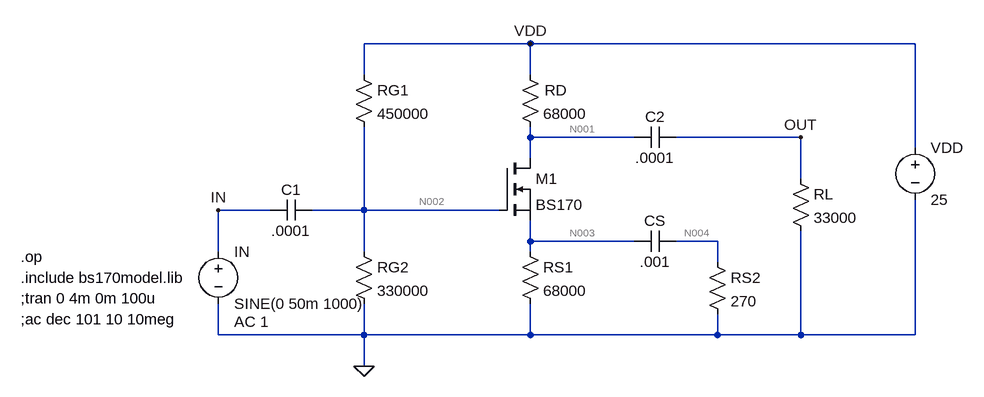
[diagram p0: schematic lab 3.asc]
lab 3.asc, the LTspice schematic file:
Version 4
SHEET 1 880 680
WIRE 128 -64 -128 -64
WIRE 720 -64 128 -64
WIRE -128 -16 -128 -64
WIRE 128 -16 128 -64
WIRE 128 80 128 64
WIRE 288 80 128 80
WIRE 544 80 352 80
WIRE 720 96 720 -64
WIRE 128 112 128 80
WIRE 544 144 544 80
WIRE -272 192 -352 192
WIRE -128 192 -128 64
WIRE -128 192 -208 192
WIRE 80 192 -128 192
WIRE 128 240 128 208
WIRE 288 240 128 240
WIRE 416 240 352 240
WIRE -352 256 -352 192
WIRE -128 256 -128 192
WIRE 128 256 128 240
WIRE 416 272 416 240
WIRE -352 384 -352 336
WIRE -128 384 -128 336
WIRE -128 384 -352 384
WIRE 128 384 128 336
WIRE 128 384 -128 384
WIRE 416 384 416 352
WIRE 416 384 128 384
WIRE 544 384 544 224
WIRE 544 384 416 384
WIRE 720 384 720 176
WIRE 720 384 544 384
WIRE -128 432 -128 384
FLAG -128 432 0
FLAG -352 192 IN
FLAG 128 -64 VDD
FLAG 544 80 OUT
SYMBOL voltage 720 80 R0
WINDOW 123 0 0 Left 2
WINDOW 39 0 0 Left 2
SYMATTR InstName VDD
SYMATTR Value 25
SYMBOL res -144 -32 R0
SYMATTR InstName RG1
SYMATTR Value 450000
SYMBOL res 112 -32 R0
WINDOW 0 38 40 Left 2
SYMATTR InstName RD
SYMATTR Value 68000
SYMBOL res -144 240 R0
SYMATTR InstName RG2
SYMATTR Value 330000
SYMBOL res 112 240 R0
SYMATTR InstName RS1
SYMATTR Value 68000
SYMBOL nmos 80 112 R0
SYMATTR InstName M1
SYMATTR Value BS170
SYMBOL cap 352 64 R90
WINDOW 0 0 32 VBottom 2
WINDOW 3 32 32 VTop 2
SYMATTR InstName C2
SYMATTR Value .0001
SYMBOL cap 352 224 R90
WINDOW 0 0 32 VBottom 2
WINDOW 3 32 32 VTop 2
SYMATTR InstName CS
SYMATTR Value .001
SYMBOL res 400 256 R0
SYMATTR InstName RS2
SYMATTR Value 270
SYMBOL res 528 128 R0
SYMATTR InstName RL
SYMATTR Value 33000
SYMBOL voltage -352 240 R0
WINDOW 123 24 124 Left 2
WINDOW 39 0 0 Left 2
SYMATTR Value2 AC 1
SYMATTR InstName IN
SYMATTR Value SINE(0 50m 1000)
SYMBOL cap -208 176 R90
WINDOW 0 0 32 VBottom 2
WINDOW 3 32 32 VTop 2
SYMATTR InstName C1
SYMATTR Value .0001
TEXT -656 264 Left 2 !.op
TEXT -656 296 Left 2 !.include bs170model.lib
TEXT -656 328 Left 2 !;tran 0 4m 0m 100u
TEXT -656 360 Left 2 !;ac dec 101 10 10meg

The netlist it stands for:
* lab 3.asc
VDD VDD 0 25
RG1 VDD N002 450000
RD VDD N001 68000
RG2 N002 0 330000
RS1 N003 0 68000
M1 N001 N002 N003 N003 BS170
C2 OUT N001 .0001
CS N004 N003 .001
RS2 N004 0 270
RL OUT 0 33000
V§IN IN 0 SINE(0 50m 1000) AC 1
C1 N002 IN .0001
.model NMOS NMOS
.model PMOS PMOS
.lib standard.mos
.op
.include bs170model.lib
;tran 0 4m 0m 100u
;ac dec 101 10 10meg
.backanno
.end

* Results of the author's LTspice run, read from the files saved beside the schematic
* Operating Point:
*   V(vdd) = 25 V
*   V(n002) = 10.58 V
*   V(n001) = 16.56 V
*   V(n003) = 8.436 V
*   V(out) = 54.66 pV
*   V(n004) = 2.278 pV
*   V(in) = 0 V
*   Id(M1) = 124.2 µA
*   Ig(M1) = 0 A
*   Ib(M1) = -8.138 pA
*   Is(M1) = -124.2 µA
*   I(C1) = 1.058 fA
*   I(Cs) = -8.436 fA
*   I(C2) = -1.656 fA
*   I(Rl) = 1.656 fA
*   I(Rs2) = 8.436 fA
*   I(Rs1) = 124.1 µA
*   I(Rg2) = 32.05 µA
*   I(Rd) = 124.1 µA
*   I(Rg1) = 32.05 µA
*   I(In) = 1.058 fA
*   I(Vdd) = -156.1 µA
* From the log:
*   Semiconductor Device Operating Points:
*                           --- MOSFET Transistors ---
*   Name:          m1
*   Model:        bs170
*   Id:          1.24e-04
*   Vgs:         2.14e+00
*   Vds:         8.13e+00
*   Vbs:         0.00e+00
*   Vth:         2.22e+00
*   Vdsat:       7.90e-02
*   Gm:          1.52e-03
*   Gds:         2.28e-06
*   Gmb:         9.93e-05
*   Cbd:         2.99e-11
*   Cbs:         0.00e+00
*   Cgsov:       2.80e-11
*   Cgdov:       2.00e-12
*   Cgbov:       1.00e-14
*   Cgs:         6.73e-14
*   Cgd:         0.00e+00
*   Cgb:         1.86e-14